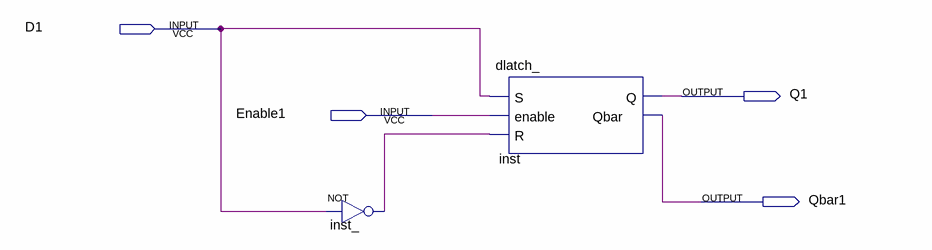
[diagram p0: schematic sheet]
// Quartus schematic dlatch_pttwo.bdf as structural Verilog: 2 symbols, 4 pins
module dlatch_pttwo (
  input  D1,
  input  Enable1,
  output Q1,
  output Qbar1
);

  wire inst__out;

  not inst_ (inst__out, D1);
  dlatch_ inst (.S(D1), .enable(Enable1), .R(inst__out), .Q(Q1), .Qbar(Qbar1));
endmodule
